# Altium schematic sheet SXLP-450+.SchDoc: Callisto Visnjan - Low Pass Filter
size A4; DrawnBy: Marko Radolovic; SheetNumber: 1; SheetTotal: 1
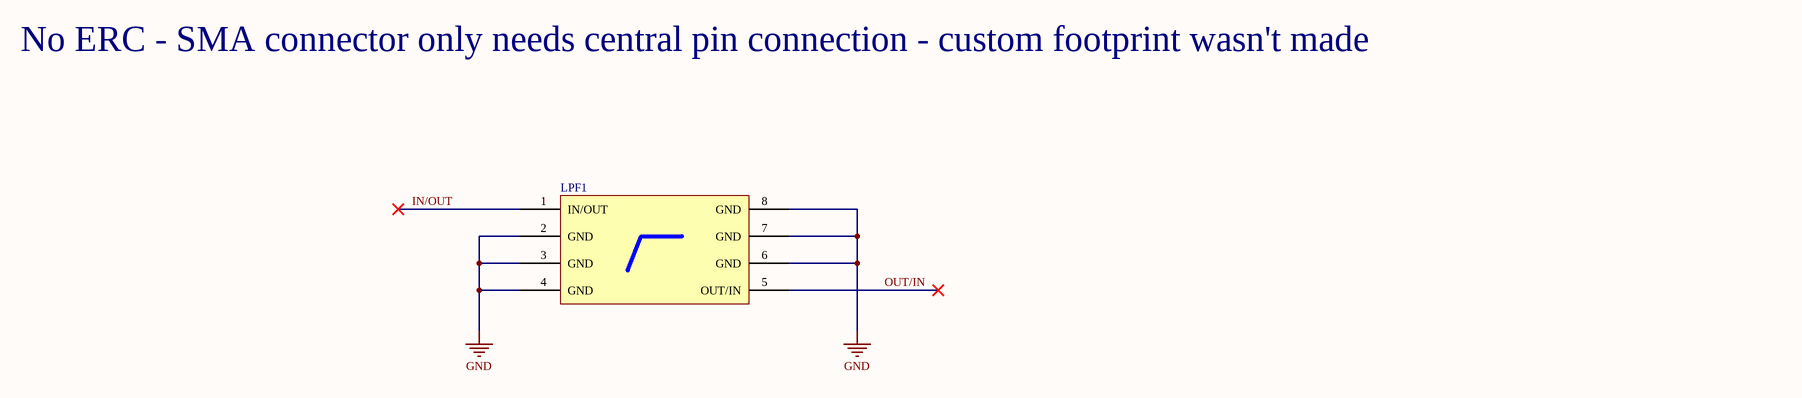
[diagram p0: SXLP-450+.SchDoc]

## Parts
LPF1  (no value)  [SXLP-450+]

## Nets
GND: LPF1.2(GND) LPF1.3(GND) LPF1.4(GND) LPF1.6(GND) LPF1.7(GND) LPF1.8(GND)
IN/OUT: LPF1.1(IN/OUT)
OUT/IN: LPF1.5(OUT/IN)

## Notes on the sheet
- No ERC - SMA connector only needs central pin connection - custom footprint wasn't made

## Library data of the parts
LPF1 = SXLP-450+: SXLP-450+, Low Pass Filter, Mini Circuits, DC to 450 MHz